# EAGLE design ThermoHygroMeter_1V0 (EAGLE 7.5.0)
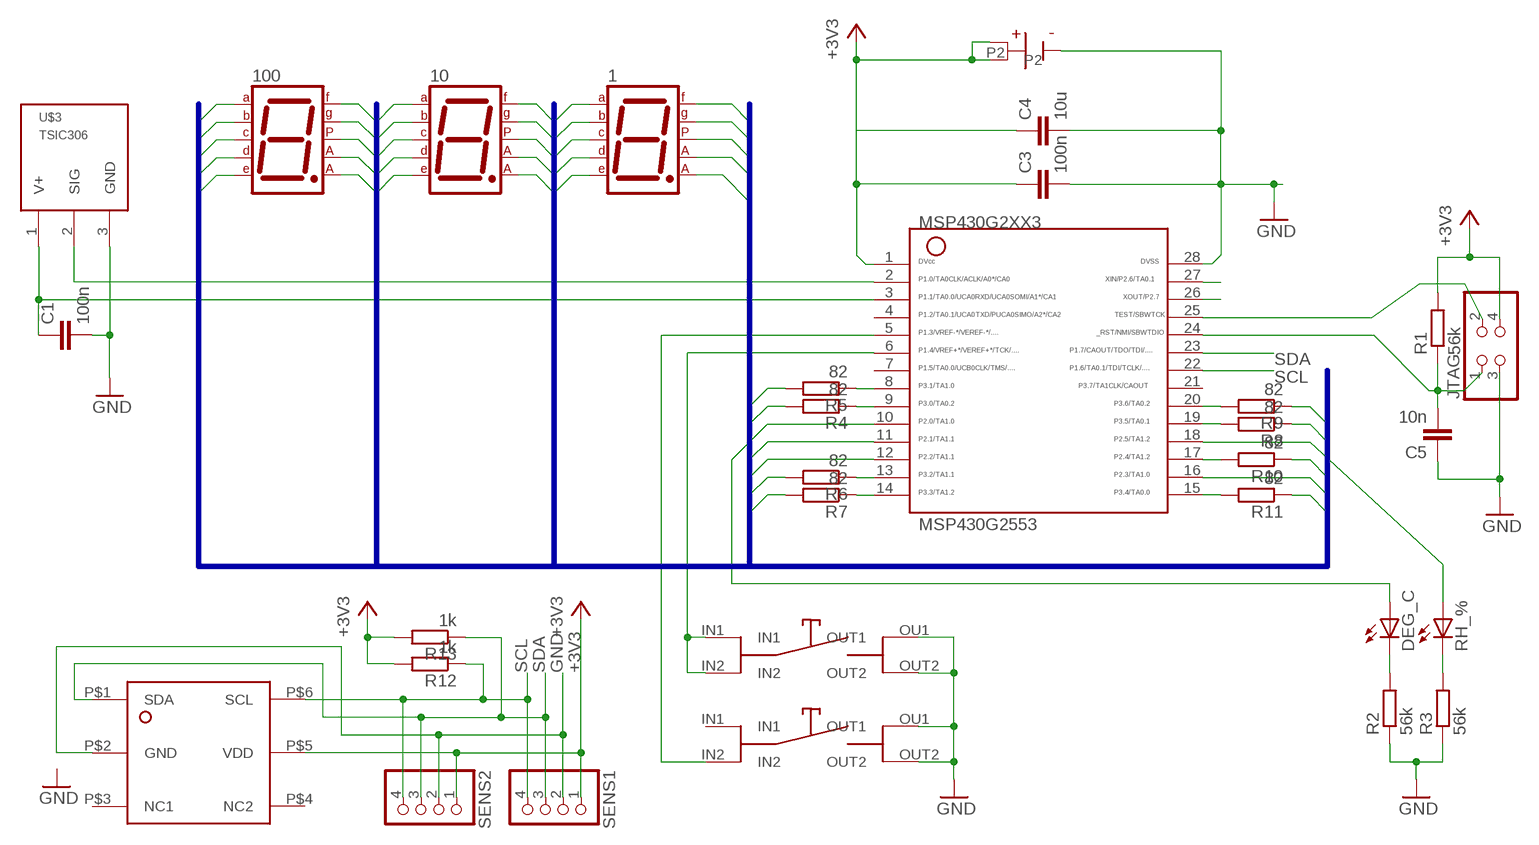
[diagram p0: schematic, sheet 1]

## Parts
1  7SEG-CA  [7SEG-13]
10  7SEG-CA  [7SEG-13]
100  7SEG-CA  [7SEG-13]
C1  100n  C-EUC0805K  [C0805K]
C3  100n  C-EUC0805K  [C0805K]
C4  10u  C-EUC1808  [C1808]
C5  10n  C-EUC0805K  [C0805K]
DEG_C  LED3MM  [LED3MM]
JTAG  PINHD-2X2  [2X02]
MSP430G2553  G2XX3---PW28  [PW28]
R1  56k  R-EU_R0805  [R0805]
R2  56k  R-EU_R0805  [R0805]
R3  56k  R-EU_R0805  [R0805]
R4  82  R-EU_R0805  [R0805]
R5  82  R-EU_R0805  [R0805]
R6  82  R-EU_R0805  [R0805]
R7  82  R-EU_R0805  [R0805]
R8  82  R-EU_R0805  [R0805]
R9  82  R-EU_R0805  [R0805]
R10  82  R-EU_R0805  [R0805]
R11  82  R-EU_R0805  [R0805]
R12  1k  R-EU_R0805  [R0805]
R13  1k  R-EU_R0805  [R0805]
RH_%  LED3MM  [LED3MM]
SENS1  PINHD-1X4  [1X04]
SENS2  PINHD-1X4  [1X04]
SENSOR  HDKJ  [HDKJ]
TEMP/RH  HDKJ  [HDKJ]
U$1  LITHIUM320SMD  [KZH20SMD]
U$3  TSIC306  [TO92-]
U$5  HDC1050  [SON6]

## Nets
1: 1.3(CA1) 1.8(CA2) MSP430G2553.16
10: 10.3(CA1) 10.8(CA2) MSP430G2553.12
100: 100.3(CA1) 100.8(CA2) MSP430G2553.11
+3V3: C3.1 C4.1 JTAG.4 MSP430G2553.1 R1.2 R12.2 R13.2 SENS1.1 SENS2.1 U$1.P1 U$1.P2 U$5.P$5(VDD)
DEG: DEG_C.A MSP430G2553.10
GND: C1.2 C3.2 C4.2 C5.1 JTAG.3 MSP430G2553.28 R2.1 R3.1 SENS1.2 SENS2.2 SENSOR.OU1(OUT1) SENSOR.OUT2 TEMP/RH.OU1(OUT1) TEMP/RH.OUT2 U$1.N U$3.3(GND) U$5.P$2(GND)
K1: 1.7(A) 10.7(A) 100.7(A) R4.2
K2: 1.6(B) 10.6(B) 100.6(B) R5.2
K3: 1.4(C) 10.4(C) 100.4(C) R6.2
K4: 1.2(D) 10.2(D) 100.2(D) R7.2
K5: 1.1(E) 10.1(E) 100.1(E) R11.1
K6: 1.9(F) 10.9(F) 100.9(F) R8.1
K7: 1.10(G) 10.10(G) 100.10(G) R9.1
K8: 1.5(DP) 10.5(DP) 100.5(DP) R10.1
N$1: MSP430G2553.2 U$3.2(SIG)
N$2: DEG_C.K(C) R2.2
N$3: C1.1 MSP430G2553.3 U$3.1(V+)
N$5: MSP430G2553.8 R5.1
N$6: R3.2 RH_%.K(C)
N$7: MSP430G2553.17 R10.2
N$8: MSP430G2553.9 R4.1
N$9: MSP430G2553.6 TEMP/RH.IN1 TEMP/RH.IN2
N$10: MSP430G2553.5 SENSOR.IN2
N$11: MSP430G2553.13 R6.1
N$12: MSP430G2553.14 R7.1
N$13: MSP430G2553.26
N$14: MSP430G2553.20 R9.2
N$15: MSP430G2553.19 R8.2
N$16: MSP430G2553.15 R11.2
N$17: MSP430G2553.27
RH: MSP430G2553.18 RH_%.A
RST: C5.2 JTAG.1 MSP430G2553.24 R1.1
SCL: MSP430G2553.22 R12.1 SENS1.4 SENS2.4 U$5.P$6(SCL)
SDA: MSP430G2553.23 R13.1 SENS1.3 SENS2.3 U$5.P$1(SDA)
TST: JTAG.2 MSP430G2553.25
Unconnected: MSP430G2553.4 MSP430G2553.7 MSP430G2553.21 SENSOR.IN1 U$5.P$3(NC1) U$5.P$4(NC2)

## Buses
LEDBUS:K[1..8],HTA,HOA,MTA,MOA

## Library data of the parts
1 10 100 = special:7SEG-CA: 7-segment DISPLAY single anode, 13 mm
C1 C3-C5 = rcl:C-EU: CAPACITOR, European symbol
DEG_C RH_% = led:LED: LED OSRAM: - CHIPLED LG R971, LG N971, LY N971, LG Q971, LY Q971, LO R971, LY R971 LH N974, LH R974 LS Q976, LO Q976, LY Q976 LO Q996 - Hyper CHIPLED LW Q18S LB Q993, LB Q99A, LB R99A - SideLED LS A670, LO A670, LY A670, LG A670, LP A670 LB A673, LV A673, LT A673, LW A673 LH A674 LY A675 LS A676, LA A676, LO A676, LY A676, LW A676 LS A679, LY A679, LG A679 - Hyper Micro SIDELED® LS Y876, LA Y876, LO Y876, LY Y876 LT Y87S - SmartLED LW L88C, LW L88S LB L89C, LB L89S, LG L890 LS L89K, LO L89K, LY L89K LS L896, LA L896, LO L896, LY L896 - TOPLED LS T670, LO T670, LY T670, LG T670, LP T670 LSG T670, LSP T670, LSY T670, LOP T670, LYG T670 LG T671, LOG T671, LSG T671 LB T673, LV T673, LT T673, LW T673 LH T674 LS T676, LA T676, LO T676, LY T676, LB T676, LH T676, LSB T676, LW T676 LB T67C, LV T67C, LT T67C, LS T67K, LO T67K, LY T67K, LW E67C LS E67B, LA E67B, LO E67B, LY E67B, LB E67C, LV E67C, LT E67C LW T67C LS T679, LY T679, LG T679 LS T770, LO T770, LY T770, LG T770, LP T770 LB T773, LV T773, LT T773, LW T773 LH T774 LS E675, LA E675, LY E675, LS T675 LS T776, LA T776, LO T776, LY T776, LB T776 LHGB T686 LT T68C, LB T68C - Hyper Mini TOPLED® LB M676 - Mini TOPLED Santana® LG M470 LS M47K, LO M47K, LY M47K Source: http://www.osram.convergy.de LUXEON: - LUMILED® LXK2-PW12-R00, LXK2-PW12-S00, LXK2-PW14-U00, LXK2-PW14-V00 LXK2-PM12-R00, LXK2-PM12-S00, LXK2-PM14-U00 LXK2-PE12-Q00, LXK2-PE12-R00, LXK2-PE12-S00, LXK2-PE14-T00, LXK2-PE14-U00 LXK2-PB12-K00, LXK2-PB12-L00, LXK2-PB12-M00, LXK2-PB14-N00, LXK2-PB14-P00, LXK2-PB14-Q00 LXK2-PR12-L00, LXK2-PR12-M00, LXK2-PR14-Q00, LXK2-PR14-R00 LXK2-PD12-Q00, LXK2-PD12-R00, LXK2-PD12-S00 LXK2-PH12-R00, LXK2-PH12-S00 LXK2-PL12-P00, LXK2-PL12-Q00, LXK2-PL12-R00 Source: www.luxeon.com KINGBRIGHT: KA-3528ASYC Source: www.kingbright.com
JTAG = pinhead:PINHD-2X2: PIN HEADER
MSP430G2553 = TI_MSP430_v16:G2XX3---PW28: MSP430G2XX1 TSSOP (PW) 28 Pin Package
R1-R13 = rcl:R-EU_: RESISTOR, European symbol
SENS1 SENS2 = pinhead02:PINHD-1X4: PIN HEADER
SENSOR TEMP/RH = Taster:HDKJ: Taster 1xEIN
U$1 = Batholder:LITHIUM3: REICHELT Order#: KZH 20SMD and KZH 20P
U$3 = TSIC:TSIC306: TSIC206 & TSIC306 Temperature Sensor
U$5 = texas:HDC1050: HDC1050 http://www.ti.com/lit/ds/symlink/hdc1050.pdf

## Board
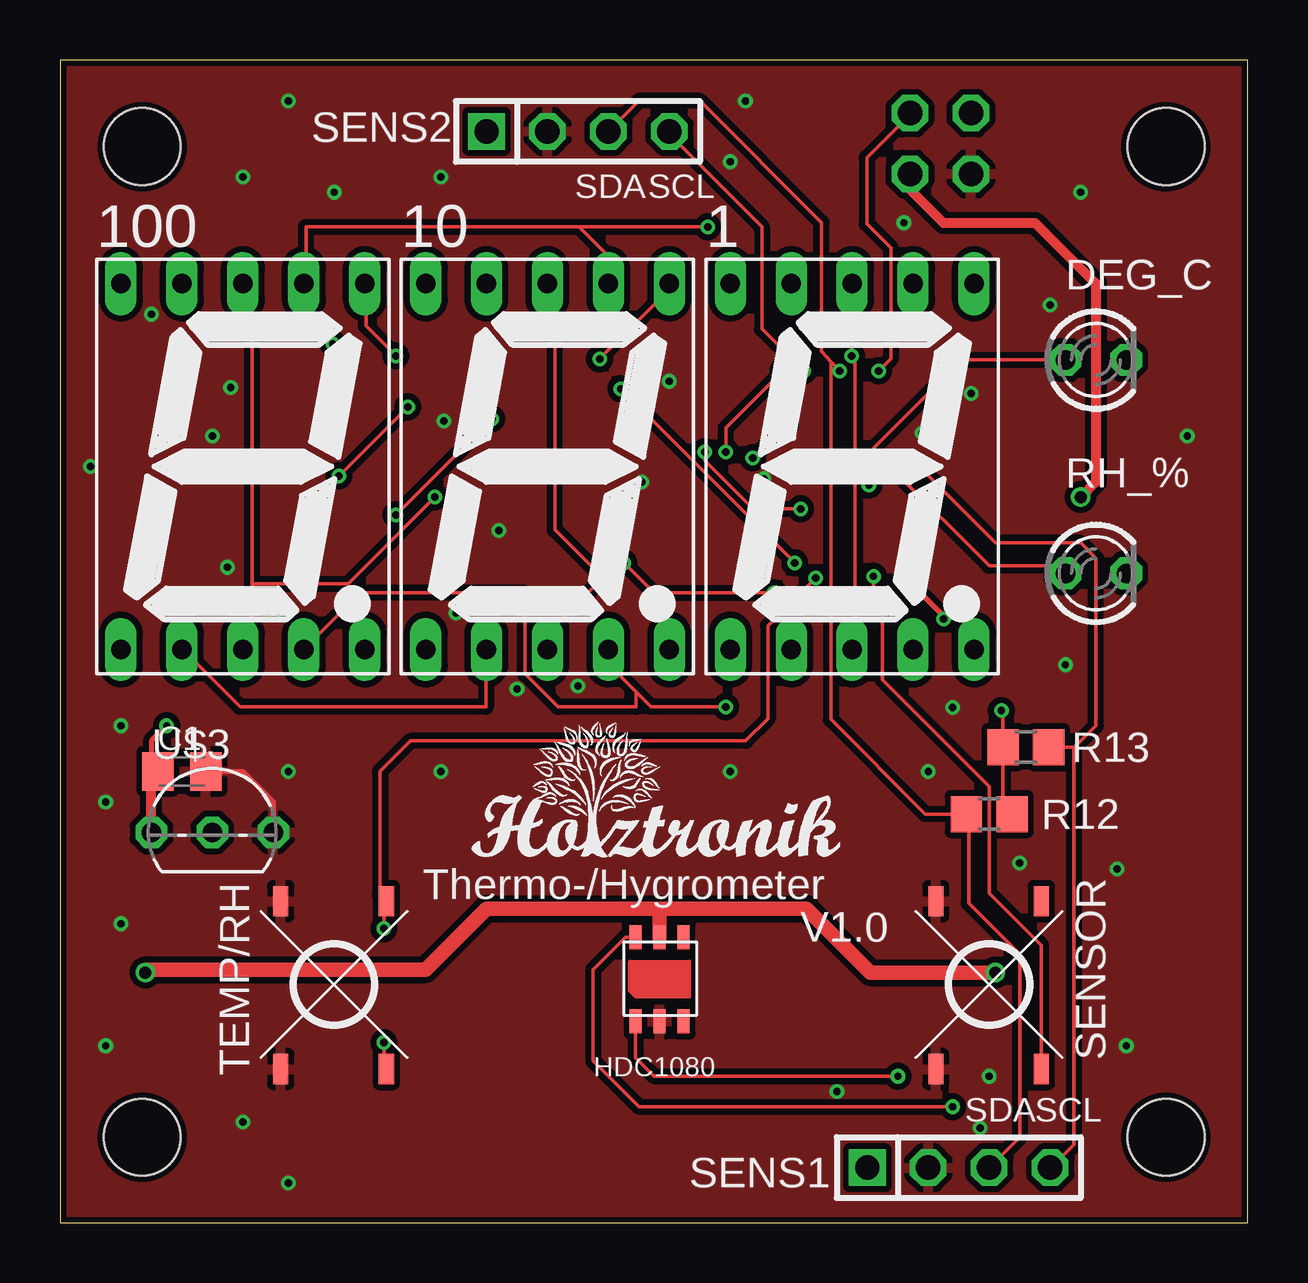
[diagram p1: board, top side]
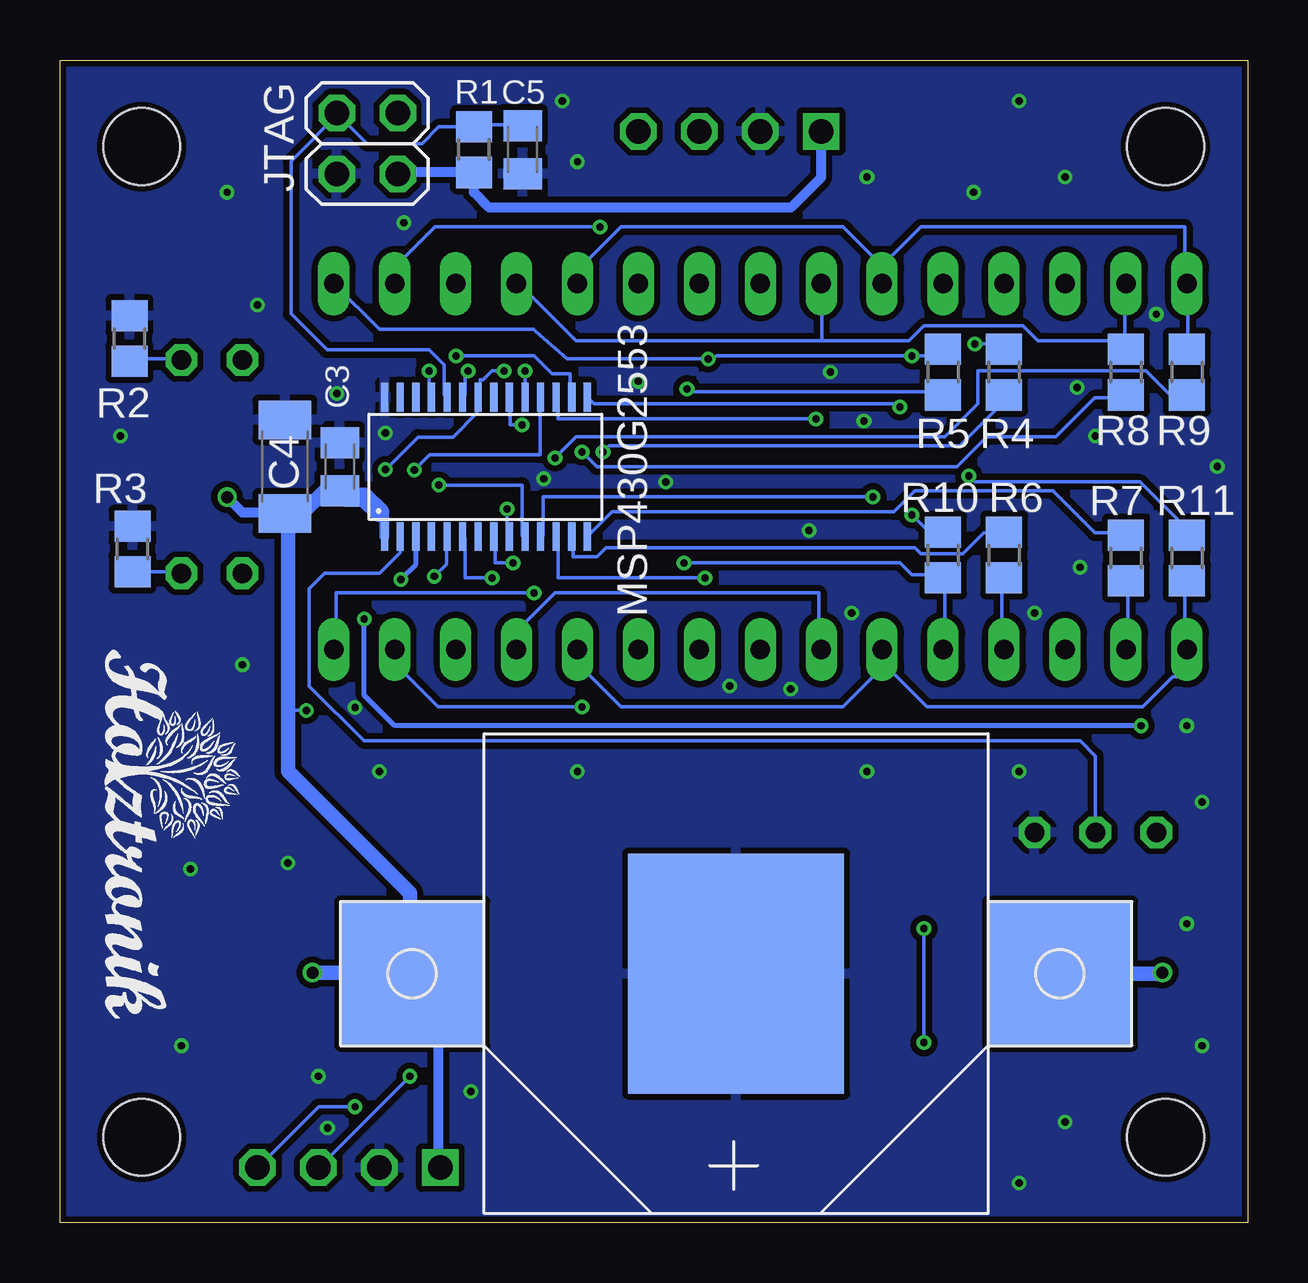
[diagram p2: board, bottom side, seen from below]

Size 49.51 x 48.44 mm. Coordinates in mm from the lower left corner, seen from the top.
Outline: 0,0 49.51,0 49.51,48.44 0,48.44 0,0
Copper layers (1*16): Top 0.035mm / dielectric 1.5mm / Bottom 0.035mm
Design rules "Elecrow_2-layer_eagle_rule": minimum track width 6mil, minimum drill 12mil, track to track 6mil, track to pad 6mil, pad to pad 6mil, via to via 6mil, smd to smd 0mil, copper to edge 10mil, drill to drill 10mil, minimum pad ring 10mil, minimum via ring 6mil, stop-mask expansion 2mil, vias tented up to drill 100mil, thermal gap 10mil
Holes 3.2 mm at 3.43,3.56 46.1,3.56 3.43,44.83 46.1,44.83

### Footprints (pad centres in the part's own frame; a part is rotated, then mirrored left to right if it is on the bottom)
7SEG-13 = drill 0.813 long: 1 -5.08,-7.62; 2 -2.54,-7.62; 3 0,-7.62; 4 2.54,-7.62; 5 5.08,-7.62; 6 5.08,7.62; 7 2.54,7.62; 8 0,7.62; 9 -2.54,7.62; 10 -5.08,7.62
C0805K = smd 1.3 x 1.6: 1 -1,0; 2 1,0
C1808 = smd 1.6 x 2.2: 1 -1.95,0; 2 1.95,0
LED3MM = drill 0.813 octagon: A -1.27,0; K 1.27,0
2X02 = drill 1.016 octagon: 1 -1.27,-1.27; 2 -1.27,1.27; 3 1.27,-1.27; 4 1.27,1.27
PW28 = smd 0.3 x 1.2: 1 -4.229,-2.908; 2 -3.579,-2.908; 3 -2.929,-2.908; 4 -2.279,-2.908; 5 -1.629,-2.908; 6 -0.979,-2.908; 7 -0.329,-2.908; 8 0.321,-2.908; 9 0.971,-2.908; 10 1.621,-2.908; 11 2.271,-2.908; 12 2.921,-2.908; 13 3.571,-2.908; 14 4.221,-2.908; 15 4.221,2.892; 16 3.571,2.892; 17 2.921,2.892; 18 2.271,2.892; 19 1.621,2.892; 20 0.971,2.892; 21 0.321,2.892; 22 -0.329,2.892; 23 -0.979,2.892; 24 -1.629,2.892; 25 -2.279,2.892; 26 -2.929,2.892; 27 -3.579,2.892; 28 -4.229,2.892
R0805 = smd 1.3 x 1.5: 1 -0.95,0; 2 0.95,0
1X04 = drill 1.016 square: 1 -3.81,0 | drill 1.016 octagon: 2 -1.27,0; 3 1.27,0; 4 3.81,0
HDKJ = smd 1.27 x 0.635: IN1 -3.48,2.17; IN2 3.51,2.17; OU1 -3.48,-2.23; OUT2 3.51,-2.23
KZH20SMD = smd 9 x 10: N 15.5,3 | smd 6 x 6: P1 2,3; P2 29,3
TO92- = drill 0.813 octagon: 1 -2.54,0; 2 0,0; 3 2.54,0
SON6 = smd 0.508 x 1.016: P$1 0.5,-0.25; P$2 1.5,-0.25; P$3 2.5,-0.25; P$4 2.5,3.25; P$5 1.5,3.25; P$6 0.5,3.25

### Placement (x,y rotation side)
1  33.02,31.5 0 top
10  20.32,31.5 0 top
100  7.62,31.5 0 top
C1  5.08,18.8 0 top
C3  37.85,31.5 90 bottom
C4  40.13,31.5 90 bottom
C5  30.23,44.7 90 bottom
DEG_C  43.18,35.94 0 top
JTAG  36.7,44.96 270 bottom
MSP430G2553  31.75,31.5 0 bottom
R1  32.26,44.7 270 bottom
R2  46.61,36.83 270 bottom
R3  46.48,28.07 270 bottom
R4  10.16,35.43 90 bottom
R5  12.7,35.43 90 bottom
R6  10.16,27.81 270 bottom
R7  5.08,27.69 270 bottom
R8  5.08,35.43 270 bottom
R9  2.54,35.43 270 bottom
R10  12.7,27.81 90 bottom
R11  2.54,27.69 90 bottom
R12  40.26,19.81 180 top
R13  38.73,17.02 0 top
RH_%  43.18,27.05 0 top
SENS1  37.47,2.29 0 top
SENS2  21.59,45.47 0 top
SENSOR  38.73,9.91 270 top
TEMP/RH  11.43,9.91 270 top
U$1  36.83,7.37 0 bottom
U$2  [HOLZTRONIK4]  16.51,14.35 0 top
U$3  6.35,16.26 0 top
U$4  [HOLZTRONIK4]  48.51,24.51 270 bottom
U$5  23.5,8.64 0 top

### Tracks (layer width: path | path; a pad name or v marks a point on that pad's centre or on a via)
1  (via drill 0.3)
  Top 0.152: 1.8 33,39.11 v33,36.11 33.12,35.99 33.12,23.99 1.3
  Bottom 0.152: v33,36.11 29.75,36.11 29,35.36 28.25,35.36 28.25,34.49 MSP430G2553.16
10  (via drill 0.3)
  Top 0.152: 10.3 20.38,23.99 20.38,24.61 v22.62,26.86 20.62,28.86 20.62,38.86 20.38,39.11 10.8
  Bottom 0.152: v22.62,26.86 28.75,26.86 28.75,28.49 MSP430G2553.12
100  (via drill 0.3)
  Top 0.152: v15.62,30.24 12,26.61 8,26.61 | 8,26.61 8,25.11 7.62,24.74 7.62,23.99 100.3 | 100.8 8,38.74 8,26.61
  Bottom 0.152: v15.62,30.24 29.38,30.24 29.38,28.61 MSP430G2553.11
+3V3  (via drill 0.3, 0.5)
  Top 0.152: R13.2 39.31,17.39 R12.2 39.31,21.27 v39.24,21.34
  Top 0.406: JTAG.4 35.43,43.05 36.83,41.66 40.64,41.66 43.18,39.12 43.18,30.86 v42.55,30.23
  Top 0.61: v3.56,10.41 3.68,10.54 15.24,10.54 17.78,13.08 25,13.08 | 25,13.08 31.11,13.08 33.78,10.41 v38.99,10.41 | U$5.P$5 25,13.08
  Bottom 0.152: v39.24,21.34 40.01,21.34 40.01,29.42 | 34.62,9.87 33.75,9.87 | U$1.P1 34.83,9.37 34.92,9.27 34.92,10.54 | 33.75,2.37 SENS1.1
  Bottom 0.406: MSP430G2553.1 35.98,29.38 36.2,29.59 | 33.75,9.87 33.75,2.37 | v42.55,30.23 41.91,29.59 40.01,29.59 40.01,28.96 | JTAG.4 35.37,43.75 R1.2 32.26,42.93 31.62,42.29 19.05,42.29 17.78,43.56 SENS2.1
  Bottom 0.61: C3.1 38.47,30.5 39.37,29.59 40.01,29.59 40.09,29.59 C4.1 40.01,29.42 | U$1.P2 3.6,10.37 v3.56,10.41 | v38.99,10.41 34.88,10.41 U$1.P1 | 33.75,9.87 34.89,9.87 34.92,9.91 34.92,10.54 34.92,13.72 40.01,18.8 40.01,28.96
  Bottom 0.813: 36.2,29.59 36.83,30.23 37.58,30.23 C3.1
DEG  (via drill 0.3)
  Top 0.152: v33.72,30.73 33.91,30.91 33.91,32.26 37.59,35.94 DEG_C.A
  Bottom 0.152: v33.72,30.73 30.25,30.73 30.25,28.61 MSP430G2553.10
GND  (via drill 0.3)
  Top 0.203: C1.2 7.62,18.8 8.89,17.53 U$3.3
  other vias: 32.38,5.46 27.94,18.8 36.2,18.8 44.45,7.37 44.07,14.73 46.99,32.77 42.55,42.93 37.21,21.46 41.91,23.24 15.88,18.8 9.53,18.8 2.54,12.45 2.54,20.7 1.91,7.37 1.91,17.53 1.27,31.5 7.62,43.56 9.53,46.74 27.94,44.2 9.53,1.65 7.62,4.19 18.29,28.83 25.4,35.05 29.34,30.99 24.26,30.86 17.4,35.43 16,33.4 6.35,32.77 15.88,43.56 11.43,42.93 28.57,46.74 35.18,41.66 41.27,38.23 35.94,32.89 37.97,34.54 3.81,37.85 7.11,34.8 38.73,6.1 40.01,14.99 38.35,3.94 21.59,22.35 16.51,25.4 8.89,25.4 6.99,27.3 19.05,22.22
  pour Bottom (isolate 0.254, rank 2): 0.38,48.01 49.15,48.01 49.15,0.38 0.38,0.38
  pour Top (isolate 0.254, rank 2): 0.38,0.38 49.15,0.38 49.15,48.01 0.38,48.01
K1  (via drill 0.3)
  Top 0.152: v11.38,36.61 10.25,37.74 10.25,39.11 100.7 10.25,39.24 10.25,41.49 21.64,41.49 | 21.64,41.49 23.01,40.11 23.01,39.61 22.75,39.24 10.7 | 21.64,41.49 v27,41.49
  Bottom 0.152: v11.38,36.61 10.38,36.61 10.25,36.49 R4.2 | 1.7 35.5,39.24 35.5,40.24 35.12,40.24 33.88,41.49 v27,41.49
K2  (via drill 0.3)
  Top 0.152: v14,36.11 12.75,37.36 12.75,39.11 100.6 | v22.49,35.99 25.13,38.62 25.38,38.87 25.38,39.11 10.6
  Bottom 0.152: R5.2 12.75,36.36 13,36.11 v14,36.11 22.11,36.11 v22.49,35.99 28.38,35.99 29.68,37.13 29.77,37.21 36.2,37.21 1.6 38.12,39.11
K3  (via drill 0.3)
  Top 0.152: 10.4 23.38,23.36 23.38,22.74 24,22.11 | 24,22.11 24.62,21.49 v27.75,21.49 | 24,22.11 24,21.49 20.75,21.49 19.38,22.86 19.38,26.24 12.5,26.24 10.25,23.99 100.4
  Bottom 0.152: R6.2 10.25,26.86 10.25,23.99 100.4 | v27.75,21.49 33.75,21.49 35.5,23.24 35.5,23.86 1.4
K4
  Top 0.152: 100.2 5.12,23.86 7.5,21.49 17.75,21.49 17.75,23.86 10.2
  Bottom 0.152: R7.2 5,26.74 5,23.99 100.2 | 10.2 17.88,23.99 17.88,26.24 28.88,26.24 30.38,24.74 30.38,23.99 1.2
K5
  Bottom 0.152: R11.1 2.62,26.74 2.62,23.99 100.1 2.62,23.86 2.62,22.74 3.12,22.74 4.38,21.49 13.38,21.49 14.75,22.86 15.25,22.86 | 15.25,22.86 15.25,22.74 15.62,22.74 16.88,21.49 26.12,21.49 27.88,23.24 27.88,23.86 1.1 | 15.25,22.86 15.25,23.86 10.1 15.25,22.86
K6
  Bottom 0.152: 5.12,36.74 5.12,39.11 100.9 | 5.12,36.74 5.12,36.49 R8.1 5.12,36.74 | 17.75,36.74 17.75,39.11 10.9 | 17.75,36.74 27.99,36.74 30.38,39.12 30.38,39.11 1.9 | 5.12,36.74 8.75,36.74 9.38,37.36 13.5,37.36 14.12,36.74 17.75,36.74
K7
  Bottom 0.152: R9.1 2.5,36.49 2.5,39.11 100.10 2.62,39.24 2.62,41.49 13.62,41.49 14.88,40.24 15.25,40.24 | 15.25,40.24 15.25,39.24 10.10 15.25,40.24 | 15.25,40.24 15.62,40.24 16.88,41.49 26.12,41.49 27.88,39.74 27.88,39.24 1.10
K8  (via drill 0.3)
  Top 0.152: v23.5,27.49 24.75,26.24 | 24.75,26.24 25,25.99 25,24.36 25.38,23.99 10.5 | 24.75,26.24 v29.75,26.24
  Bottom 0.152: 100.5 12.62,23.99 12.62,26.86 R10.1 12.75,26.99 14,26.99 14.5,27.49 v23.5,27.49 | v29.75,26.24 38,26.24 38,23.99 1.5
N$1
  Bottom 0.152: MSP430G2553.2 35.33,27.92 36.2,27.05 38.48,27.05 39.12,26.42 39.12,22.35 36.83,20.07 6.99,20.07 6.35,19.43 U$3.2
N$2
  Bottom 0.152: R2.2 46.5,35.99 44.5,35.99 DEG_C.K
N$3  (via drill 0.3)
  Top 0.203: v36.83,25.15 36.83,25.27 v35.31,26.8 | v4.45,20.7 3.81,20.07 3.81,19.07 C1.1 3.81,18.53
  Top 0.406: U$3.1 3.81,18.53
  Bottom 0.203: v4.45,20.7 35.56,20.7 36.83,21.97 v36.83,25.15 | v35.31,26.8 34.67,27.43 MSP430G2553.3
N$5  (via drill 0.3)
  Top 0.152: v23.38,34.74 v30.62,27.49
  Bottom 0.152: v30.62,27.49 31.38,27.49 31.38,28.49 MSP430G2553.8 | v23.38,34.74 23.25,34.61 12.88,34.61 12.75,34.49 R5.1
N$6
  Bottom 0.152: R3.2 46.38,27.11 44.5,27.11 RH_%.K
N$7  (via drill 0.3)
  Top 0.152: v14,29.49 v18,33.49
  Bottom 0.152: v18,33.49 28.75,33.49 28.75,34.36 MSP430G2553.17 | v14,29.49 13.38,28.86 12.75,28.86 R10.2
N$8  (via drill 0.3)
  Top 0.152: v30.88,29.74 28.88,29.74 26.88,31.74 v26.88,32.11
  Bottom 0.152: v30.88,29.74 30.88,28.61 MSP430G2553.9 | v26.88,32.11 26.62,32.36 12,32.36 10.25,34.11 10.25,34.36 R4.1
N$9  (via drill 0.3)
  Top 0.152: v31.5,26.86 29.5,24.86 29.5,20.99 28.57,20.07 14.61,20.07 13.34,18.8 13.34,13.65 TEMP/RH.IN1 | 13.62,13.62 13.62,13.5 TEMP/RH.IN1 | v13.5,7.5 13.5,6.5 TEMP/RH.IN2 | v13.5,12.25 13.5,13.37 TEMP/RH.IN1
  Bottom 0.152: v31.5,26.86 32.62,26.86 32.62,28.49 MSP430G2553.6 | v13.5,12.25 v13.5,7.5
N$10  (via drill 0.3)
  Top 0.152: SENSOR.IN2 40.91,11.55 38.73,13.72 38.73,18.16 34.29,22.61 34.29,25.78 33.91,26.16 v33.91,26.92
  Bottom 0.152: v33.91,26.92 33.4,27.43 33.4,28.57 MSP430G2553.5
N$11
  Bottom 0.152: MSP430G2553.13 28.12,28.49 28.12,27.74 27.12,27.74 26.75,28.11 13.88,28.11 13.62,27.86 11.88,27.86 11,28.74 10.25,28.74 R6.1
N$12
  Bottom 0.152: MSP430G2553.14 27.5,28.61 26.5,29.61 14.75,29.61 13.88,30.49 8.12,30.49 6.38,28.74 5.12,28.74 R7.1
N$14  (via drill 0.3)
  Top 0.152: v28.88,31.86 v30.25,33.24
  Bottom 0.152: v30.25,33.24 30.75,33.24 30.75,34.36 MSP430G2553.20 | v28.88,31.86 28,32.74 12.62,32.74 11.25,34.11 11.25,35.49 4.25,35.49 3.25,34.49 2.62,34.49 R9.2
N$15  (via drill 0.3)
  Top 0.152: v30.12,35.49 27.75,33.11 v27.75,32.11
  Bottom 0.152: v30.12,35.49 30.12,34.49 MSP430G2553.19 | v27.75,32.11 27.12,31.49 12.12,31.49 10.88,32.74 8,32.74 6.38,34.36 5.12,34.36 R8.2
N$16  (via drill 0.3)
  Top 0.152: v11.62,31.11 v14.5,33.99
  Bottom 0.152: v14.5,33.99 14.62,34.11 27.25,34.11 27.5,34.36 MSP430G2553.15 | v11.62,31.11 11.38,30.86 4.5,30.86 2.62,28.99 2.62,28.74 R11.2
RH  (via drill 0.3)
  Top 0.152: v34.74,31.35 38.73,27.36 41.88,27.36 41.88,27.11 RH_%.A
  Bottom 0.152: MSP430G2553.18 29.5,34.36 29.5,31.99 34.1,31.99 v34.74,31.35
RST
  Bottom 0.152: C5.2 30.25,45.75 32.25,45.75 R1.1 33.72,45.65 34.42,44.96 36.7,44.96 JTAG.1 38,46.12 39.88,44.22 39.88,37.86 38.38,36.36 34.12,36.36 33.5,35.74 33.5,34.49 MSP430G2553.24
SCL  (via drill 0.3)
  Top 0.152: v31,35.49 29.26,37.23 29.26,41.49 25.5,45.25 25.5,45.37 SENS2.4 | 42.25,19.81 42.25,3.25 41.38,2.37 SENS1.4 | R12.1 42.25,19.81 | 42.25,19.81 42.29,19.81 43.18,20.7 43.18,27.69 42.55,28.32 38.99,28.32 v35.94,31.37 | U$5.P$6 23.57,11.89 22.23,10.54 22.23,6.73 24.13,4.83 v37.21,4.83
  Bottom 0.152: v31,35.49 31.5,35.49 31.88,35.11 32,35.11 32,34.49 MSP430G2553.22 32.12,34.36 32.12,33.73 33.13,32.72 34.59,32.72 v35.94,31.37 | v37.21,4.83 38.73,4.83 SENS1.4
SDA  (via drill 0.3)
  Top 0.152: 32.12,35.86 v32.5,35.49 | 32.12,35.86 31.74,36.3 31.74,41.66 26.67,46.74 24.13,46.74 SENS2.3 | 32.12,35.86 32.12,20.96 36.07,17.02 R13.1 37.88,16.93 | 38.62,2.37 SENS1.3 40.01,3.56 40.01,11.18 37.88,13.31 37.88,16.93 | 37.88,16.89 37.78,16.8 37.78,16.84 37.88,16.93 | U$5.P$1 24,6.87 24.77,6.1 v34.92,6.1
  Bottom 0.152: v32.5,35.49 32.62,35.49 32.62,34.49 MSP430G2553.23 | v34.92,6.1 SENS1.3
TST  (via drill 0.3)
  Top 0.152: v34.12,35.49 34.62,35.99 34.62,40.61 33.62,41.61 33.62,44.37 35.38,46.12 JTAG.2
  Bottom 0.152: v34.12,35.49 34.12,34.49 MSP430G2553.25

### Text on the board
tNames: SDA | SCL | Thermo-/Hygrometer | V1.0 | HDC1080 | SDA | SCL